# Altium schematic sheet power_supply.SchDoc: Shuttler
size 420 x 297 mm; Author: G.Kasprowicz; CompanyName: WUT ISE; DrawnBy: G.Kasprowicz; Organization: WUT ISE; Address1: PW ISE; Address2: Nowowiejska 15/19 00-665 Warsaw; Address3: gkasprow@gmail.com; DocumentNumber: 8; SheetNumber: 8; SheetTotal: 10; ModifiedBy: -; CheckedDate: -; Title2: Power supply; DivGrp: WUT ISE; Designer: G.Kasprowicz; ModifiedDate: -; ProjectName: Sensor Box
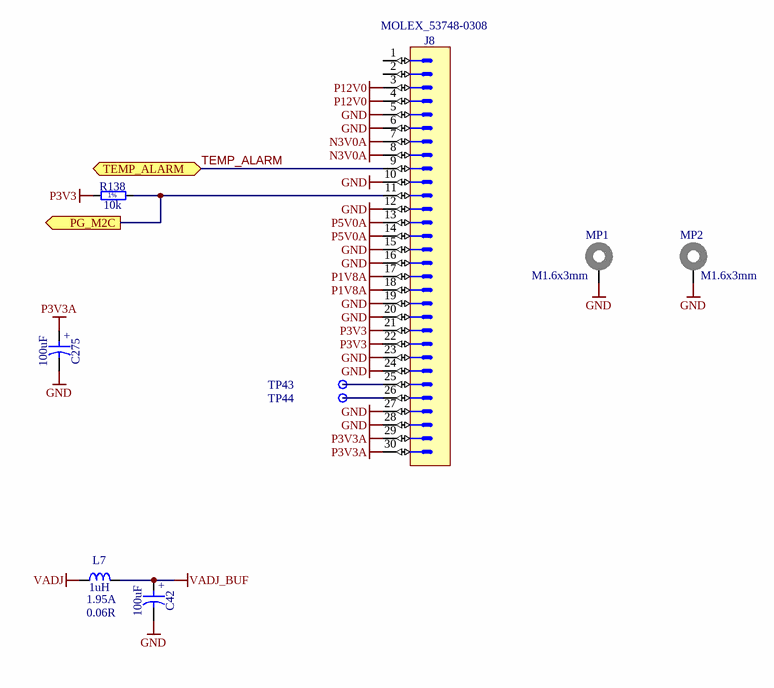
[diagram p0: power_supply.SchDoc]

## Parts
C42  100uF  [CAPMP3216X180N]
C275  100uF  [CAPMP3216X180N]
J8  SlimStack™  [MOLEX_53748-0308]  (value not drawn)
L7  1uH  Power: 1.95A  Resistance: 0.06R  [INDC2620X100N]
MP1  M1.6x3mm  [9774030633]
MP2  M1.6x3mm  [9774030633]
R138  10k  [RESC1005X40N]
TP43  Test Point  [TPS127]  (value not drawn)  (no BOM)
TP44  Test Point  [TPS127]  (value not drawn)  (no BOM)

## Ports
PG_M2C (out), TEMP_ALARM (bidir)

## Nets
GND: C42.2 C275.2 J8.5 J8.6 J8.10 J8.12 J8.15 J8.16 J8.19 J8.20 J8.23 J8.24 J8.27 J8.28 MP1.1 MP2.1
N3V0A: J8.7 J8.8
P1V8A: J8.17 J8.18
P3V3: J8.21 J8.22 R138.1
P3V3A: C275.1 J8.29 J8.30
P5V0A: J8.13 J8.14
P12V0: J8.3 J8.4
VADJ: L7.1
VADJ_BUF: C42.1 L7.2
PG_M2C: J8.11 R138.2 ; port PG_M2C
TEMP_ALARM: J8.9 ; port TEMP_ALARM
NetJ8_25: J8.25 TP43.1
NetJ8_26: J8.26 TP44.1

Not connected (* = marked no-connect by the designer): J8 1 2

## Notes on the sheet
- Project/Equipment
- Document
- Designer
- Drawn by
- Check.by
- Copyright WUT ISE 2018.
  This documentation describes Open Hardware and is licensed under the CERN OHL v.1.1. You may redistribute and modify this documentation under the terms of the CERN OHL v.1.1. (http://ohwr.org/CERNOHL). This documentation is distributed WITHOUT ANY EXPRESS OR IMPLIED WARRANTY, INCLUDING OF MERCHANTABILITY, SATISFACTORY QUALITY AND FITNESS FOR A PARTICULAR PURPOSE. Please see the CERN OHL v.1.1 for applicable conditions.
- Contact
- File
- Last Mod.
- Print Date
- Sheet
- Size
- A3
- of
- Rev
- (in symbol CTE3216-18_100UF_6.3V_20%_ESR0500_AVX_TLJ) +
- (in symbol R0402_10K_1%_0.0625W_100PPM) 1%

## Library data of the parts
C42 C275 = CTE3216-18_100UF_6.3V_20%_ESR0500_AVX_TLJ: Polarised capacitor; Part Description: ESR 0R5 Solid Tantalum Chip Capacitor; Manufacturer: AVX; Manufacturer Part Number: TLJA107M006R0500; Voltage: 6.3V; Tolerance: ±20%; Part Number: CTE3216-18_100UF_6.3V_20%_ESR0500_AVX_TLJ; Component Kind: Standard; Component Type: Standard; Pin Count: 2; Value: 100uF; Status: None; Case: A; Mounted: Yes; Socket: No; SMD: Yes; Sense: No; HelpURL: \\cern.ch\dfs\Applications\Altium\Datasheets\CTE_AVX_TLJ.pdf; Author: CERN DEM JLC; CreateDate: 19.12.2013; LatestRevisionDate: 19.12.2013; ComponentHeight: 1.8mm
J8 = MOLEX_53748-0308: Connector 30 Male; Part Description: 0.50mm Pitch SlimStack™ Dual Row 30 Circuits Surface Mount Vertical Plug (3.00 Stacking Heights); Manufacturer: MOLEX; PressFit: No; Part Number: MOLEX_53748-0308; Component Kind: Standard; Component Type: Standard; Pin Count: 30; Family: SlimStack™; Mounted: Yes; Socket: No; SMD: Yes; Sense: No; Status: None; Manufacturer Part Number: 53748-0308; ComponentHeight: 2.4mm; HelpURL: \\cern.ch\dfs\Applications\Altium\Datasheets\MOLEX_53748-0308.pdf; Author: CERN DEM JLC; CreateDate: 28.08.2012; LatestRevisionDate: 28.08.2012
L7 = IND1008_1UH_20%_WURTH_74479787210B: Inductor; Part Description: Power Multilayer Inductor (WE-PMI Series); Manufacturer: WURTH ELEKTRONIK; Tolerance: ±20%; Part Number: IND1008_1UH_20%_WURTH_74479787210B; Component Kind: Standard; Component Type: Standard; Pin Count: 2; Value: 1uH; Status: None; Manufacturer Part Number: 74479787210B; Mounted: Yes; Socket: No; SMD: Yes; Sense: No; ComponentHeight: 1mm; HelpURL: \\cern.ch\dfs\Applications\Altium\Datasheets\IND_WURTH_WE-PMI_74479787210B.pdf; Author: CERN DEM JLC; CreateDate: 01.10.2014; LatestRevisionDate: 01.10.2014; Case: 1008
MP1 MP2 = 9774030633R: WA-SMSI SMT Steel Spacer, M1.6 Thread Internal, OD 3.3mm, M1.6x3mm; Manufacturer: Wurth Elektronik; Inner Diameter: 1.9mm; Surface: Tin; ComponentLink1Description: Manufacturer; ComponentLink1URL: http://www.we-online.de; ComponentLink2Description: Datasheet; ComponentLink2URL: https://www.we-online.com/catalog/datasheet/9774030633R.pdf; Mounting Technology: SMT; Packaging: Tape and Reel; Manufacturer Part Number: 9774030633R; Length: 3mm; Inner Thread Length: -; Operating Temperature: -55 to +150degC; Outer Diameter: 3.3mm; Published Date: April 2020; Material: Steel; Thread: M1.6
R138 = R0402_10K_1%_0.0625W_100PPM: Resistor - 1%; Part Description: General Purpose Thick Film Chip Resistor; Manufacturer: GENERIC; Manufacturer1 Part Number: 232270671003L; TC: ±100ppm/°C; PressFit: No; Part Number: R0402_10K_1%_0.0625W_100PPM; Component Kind: Standard; Component Type: Standard; Pin Count: 2; Value: 10k; Status: Not Recommended; Power: 0.0625W; Tolerance: ±1%; Manufacturer Part Number: R0402_10K_1%_0.0625W_100PPM; Case: 0402; Mounted: Yes; Sense: No; Socket: No; SMD: Yes; Manufacturer1 Example: YAGEO PHYCOMP; Manufacturer1 ComponentHeight: 0.4mm; HelpURL: \\cern.ch\dfs\Applications\Altium\Datasheets\R0402_Phycomp_RC0402.pdf; Author: CERN DEM JLC; CreateDate: 03.12.2007; LatestRevisionDate: 17.10.2012
TP43 TP44 = SMD_PAD_1.27X1.27MM: Part Description: 1.27mm x 1.27mm PCB Copper Area (SMD Test Point); Mounted: No; Part Number: SMD_PAD_1.27X1.27MM; Component Type: Standard (No BOM); Pin Count: 1; Family: Test Point; Socket: No; SMD: Yes; Sense: No; Status: None; ComponentHeight: 0mm; HelpURL: Undefined; Author: CERN DEM JLC; CreateDate: 12.01.2008; LatestRevisionDate: 12.01.2008; PackageDescription: 1.27mm x 1.27mm PCB Copper Area (SMD Test Point)